# Altium schematic sheet power.SchDoc
size A4; SheetNumber: 3; SheetTotal: 6
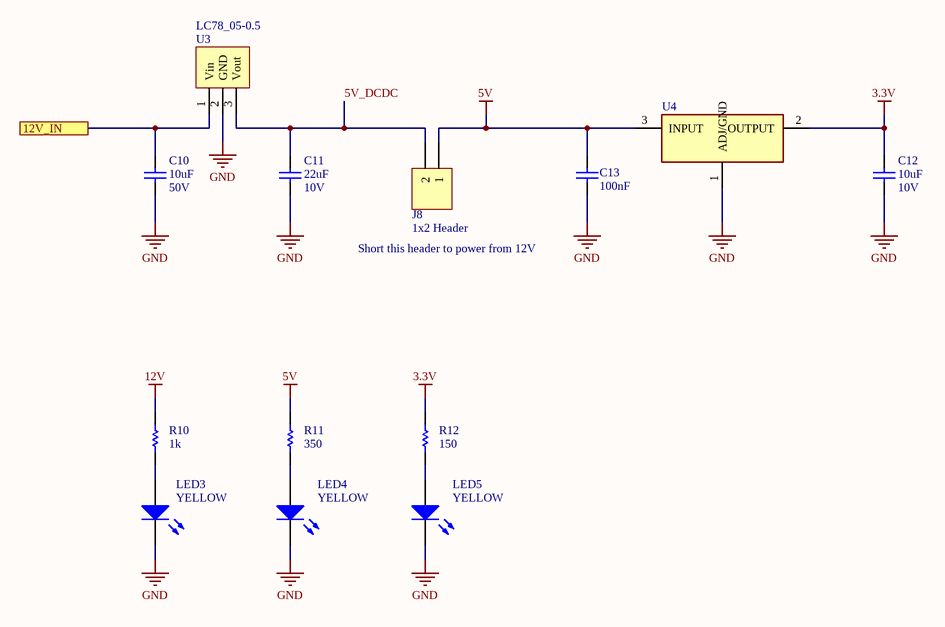
[diagram p0: power.SchDoc]

## Parts
C10  value 10uF  Volt Rating: 50V  [0805 - Capacitor]  (hidden comment: Capacitor - Nonpolarized)
C11  value 22uF  Volt Rating: 10V  [0805 - Capacitor]  (hidden comment: Capacitor - Nonpolarized)
C12  value 10uF  Volt Rating: 10V  [0805 - Capacitor]  (hidden comment: Capacitor - Nonpolarized)
C13  value 100nF  [0805 - Capacitor]  (hidden comment: Capacitor - Nonpolarized)
J8  1x2 Header  [HDR1X2]
LED3  YELLOW  [0805 - DIODE]
LED4  YELLOW  [0805 - DIODE]
LED5  YELLOW  [0805 - DIODE]
R10  value 1k  [0603 - Resistor]  (hidden comment: Resistor)
R11  value 350  [0603 - Resistor]  (hidden comment: Resistor)
R12  value 150  [0603 - Resistor]  (hidden comment: Resistor)
U3  LC78_05-0.5  [LC78_05-0.5]
U4  TLV1117-33IDCYR  [TLV1117]  (value not drawn)

## Ports
12V_IN

## Nets
3.3V: C12.2 R12.2 U4.2(OUTPUT)
5V: C13.2 J8.1 R11.2 U4.3(INPUT)
12V: R10.2
GND: C10.1 C11.1 C12.1 C13.1 LED3.2(K) LED4.2(K) LED5.2(K) U3.2(GND) U4.1(ADJ/GND)
5V_DCDC: C11.2 J8.2 U3.3(Vout)
12V_IN: C10.2 U3.1(Vin) ; port 12V_IN
NetLED3_1: LED3.1(A) R10.1
NetLED4_1: LED4.1(A) R11.1
NetLED5_1: LED5.1(A) R12.1

## Notes on the sheet
- Short this header to power from 12V

## Library data of the parts
C10-C13 = Capacitor - Nonpolarized: Nonpolarized Capacitor; Supplier Part Number: *; Supplier: *; Manufacturer: *; Rating: *; Manufacturer Part Number: *
J8 = 1x2 Header: 1x2 Pin Header
LED3-LED5 = LED: Light Emitting Diode; Value: *; Manufacturer Part Number: *; Manufacturer: *; Supplier Part Number: *; Rating: *; Supplier: *
U3 = LC78_05-0.5: Non-Isolated PoL Module DC DC Converter 1 Output 5V 500mA 6.8V - 28V Input; Manufacturer: GAPTEC Electronic. KG; Manufacturer Part Number: LC78_05-0.5; RoHS: No; Supplier 1: Digi-Key; Supplier Part Number 1: 3182-LC78_05-0.5-ND
U4 = TLV1117-33IDCYR: Linear Voltage Regulator IC 3.3V 800MA SOT223-4; Manufacturer: Texas Instruments; Manufacturer Part Number: TLV1117-33IDCYR; Supplier Part Number: 296-21112-1-ND; Supplier: Digikey; ComponentLink1Description: Datasheet; ComponentLink1URL: http://www.ti.com/lit/ds/symlink/tlv1117.pdf?HQS=TI-null-null-digikeymode-df-pf-null-wwe&ts=1590668900314
R10-R12 = Resistor: Rating: *; Manufacturer Part Number: *; Manufacturer: *; Supplier Part Number: *; Supplier: *